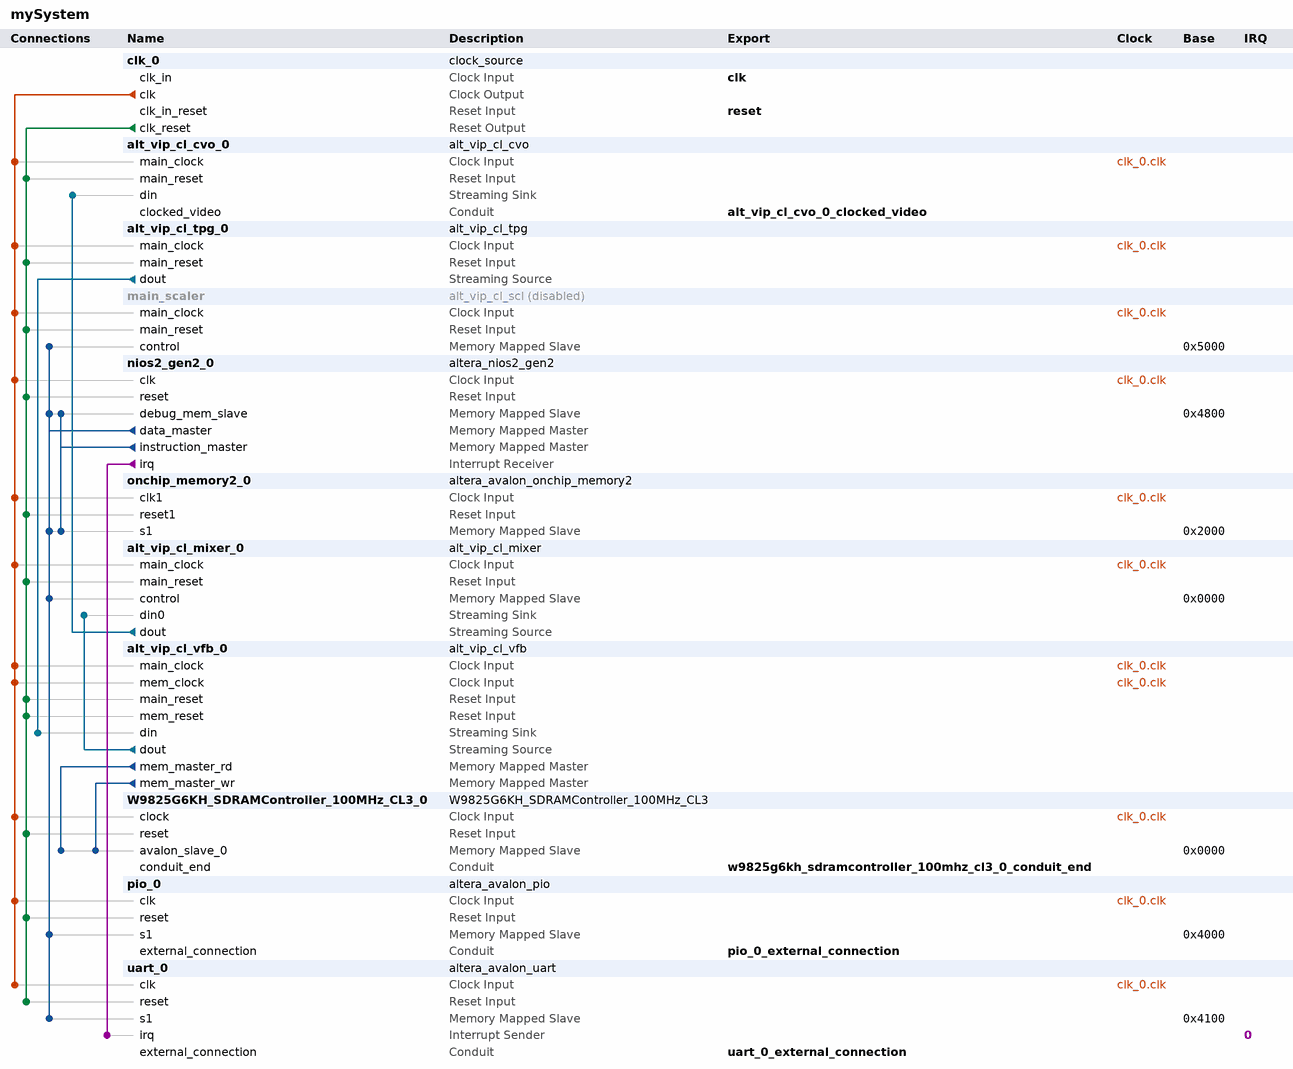
[diagram p0: system contents]
# Platform Designer (Qsys) system mySystem, Cyclone 10 LP 10CL016YU484C8G
# Parameters at their usual value, and those the tool derives, are not listed.
package require -exact qsys 18.1
create_system mySystem
set_project_property DEVICE_FAMILY {Cyclone 10 LP}
set_project_property DEVICE 10CL016YU484C8G

add_instance clk_0 clock_source 18.1
set_instance_parameter_value clk_0 clockFrequency 125000000

add_instance alt_vip_cl_cvo_0 alt_vip_cl_cvo 18.1
set_instance_parameter_value alt_vip_cl_cvo_0 ACCEPT_COLOURS_IN_SEQ 0
set_instance_parameter_value alt_vip_cl_cvo_0 ACCEPT_SYNC 0
set_instance_parameter_value alt_vip_cl_cvo_0 ANC_LINE 0
set_instance_parameter_value alt_vip_cl_cvo_0 AP_LINE 0
set_instance_parameter_value alt_vip_cl_cvo_0 BPS 8
set_instance_parameter_value alt_vip_cl_cvo_0 CLOCKS_ARE_SAME 0
set_instance_parameter_value alt_vip_cl_cvo_0 COLOUR_PLANES_ARE_IN_PARALLEL 1
set_instance_parameter_value alt_vip_cl_cvo_0 CONTEXT_WIDTH 8
set_instance_parameter_value alt_vip_cl_cvo_0 COUNT_STEP_IS_PIP_VALUE 0
set_instance_parameter_value alt_vip_cl_cvo_0 DST_WIDTH 8
set_instance_parameter_value alt_vip_cl_cvo_0 FIELD0_ANC_LINE 0
set_instance_parameter_value alt_vip_cl_cvo_0 FIELD0_V_BACK_PORCH 0
set_instance_parameter_value alt_vip_cl_cvo_0 FIELD0_V_BLANK 0
set_instance_parameter_value alt_vip_cl_cvo_0 FIELD0_V_FRONT_PORCH 0
set_instance_parameter_value alt_vip_cl_cvo_0 FIELD0_V_RISING_EDGE 0
set_instance_parameter_value alt_vip_cl_cvo_0 FIELD0_V_SYNC_LENGTH 0
set_instance_parameter_value alt_vip_cl_cvo_0 FIFO_DEPTH 640
set_instance_parameter_value alt_vip_cl_cvo_0 F_FALLING_EDGE 0
set_instance_parameter_value alt_vip_cl_cvo_0 F_RISING_EDGE 0
set_instance_parameter_value alt_vip_cl_cvo_0 GENERATE_SYNC 0
set_instance_parameter_value alt_vip_cl_cvo_0 H_ACTIVE_PIXELS 640
set_instance_parameter_value alt_vip_cl_cvo_0 H_BACK_PORCH 48
set_instance_parameter_value alt_vip_cl_cvo_0 H_BLANK 0
set_instance_parameter_value alt_vip_cl_cvo_0 H_FRONT_PORCH 16
set_instance_parameter_value alt_vip_cl_cvo_0 H_SYNC_LENGTH 96
set_instance_parameter_value alt_vip_cl_cvo_0 INTERLACED 0
set_instance_parameter_value alt_vip_cl_cvo_0 LOW_LATENCY 0
set_instance_parameter_value alt_vip_cl_cvo_0 NO_OF_CHANNELS 1
set_instance_parameter_value alt_vip_cl_cvo_0 NO_OF_MODES 1
set_instance_parameter_value alt_vip_cl_cvo_0 NUMBER_OF_COLOUR_PLANES 3
set_instance_parameter_value alt_vip_cl_cvo_0 PIXELS_IN_PARALLEL 1
set_instance_parameter_value alt_vip_cl_cvo_0 SRC_WIDTH 8
set_instance_parameter_value alt_vip_cl_cvo_0 STD_WIDTH 1
set_instance_parameter_value alt_vip_cl_cvo_0 TASK_WIDTH 8
set_instance_parameter_value alt_vip_cl_cvo_0 THRESHOLD 639
set_instance_parameter_value alt_vip_cl_cvo_0 USE_CONTROL 0
set_instance_parameter_value alt_vip_cl_cvo_0 USE_EMBEDDED_SYNCS 0
set_instance_parameter_value alt_vip_cl_cvo_0 V_ACTIVE_LINES 480
set_instance_parameter_value alt_vip_cl_cvo_0 V_BACK_PORCH 31
set_instance_parameter_value alt_vip_cl_cvo_0 V_BLANK 0
set_instance_parameter_value alt_vip_cl_cvo_0 V_FRONT_PORCH 11
set_instance_parameter_value alt_vip_cl_cvo_0 V_SYNC_LENGTH 2

add_instance alt_vip_cl_tpg_0 alt_vip_cl_tpg 18.1
set_instance_parameter_value alt_vip_cl_tpg_0 BITS_PER_SYMBOL 8
set_instance_parameter_value alt_vip_cl_tpg_0 COLOR_PLANES_ARE_IN_PARALLEL 1
set_instance_parameter_value alt_vip_cl_tpg_0 COLOR_SPACE_0 RGB_444
set_instance_parameter_value alt_vip_cl_tpg_0 COLOR_SPACE_1 RGB_444
set_instance_parameter_value alt_vip_cl_tpg_0 COLOR_SPACE_2 RGB_444
set_instance_parameter_value alt_vip_cl_tpg_0 COLOR_SPACE_3 RGB_444
set_instance_parameter_value alt_vip_cl_tpg_0 COLOR_SPACE_4 RGB_444
set_instance_parameter_value alt_vip_cl_tpg_0 COLOR_SPACE_5 RGB_444
set_instance_parameter_value alt_vip_cl_tpg_0 COLOR_SPACE_6 RGB_444
set_instance_parameter_value alt_vip_cl_tpg_0 COLOR_SPACE_7 RGB_444
set_instance_parameter_value alt_vip_cl_tpg_0 DEFAULT_BOARDER 1
set_instance_parameter_value alt_vip_cl_tpg_0 FAMILY {Cyclone 10 LP}
set_instance_parameter_value alt_vip_cl_tpg_0 INTERLACING PROGRESSIVE
set_instance_parameter_value alt_vip_cl_tpg_0 LIMITED_READBACK 0
set_instance_parameter_value alt_vip_cl_tpg_0 MAX_HEIGHT 200
set_instance_parameter_value alt_vip_cl_tpg_0 MAX_WIDTH 200
set_instance_parameter_value alt_vip_cl_tpg_0 NUMBER_OF_COLOR_PLANES 2
set_instance_parameter_value alt_vip_cl_tpg_0 NUM_CORES 1
set_instance_parameter_value alt_vip_cl_tpg_0 OUTPUT_FORMAT 4.4.4
set_instance_parameter_value alt_vip_cl_tpg_0 PATTERN_0 colorbars
set_instance_parameter_value alt_vip_cl_tpg_0 PATTERN_1 colorbars
set_instance_parameter_value alt_vip_cl_tpg_0 PATTERN_2 colorbars
set_instance_parameter_value alt_vip_cl_tpg_0 PATTERN_3 colorbars
set_instance_parameter_value alt_vip_cl_tpg_0 PATTERN_4 colorbars
set_instance_parameter_value alt_vip_cl_tpg_0 PATTERN_5 colorbars
set_instance_parameter_value alt_vip_cl_tpg_0 PATTERN_6 colorbars
set_instance_parameter_value alt_vip_cl_tpg_0 PATTERN_7 colorbars
set_instance_parameter_value alt_vip_cl_tpg_0 PIPELINE_READY 0
set_instance_parameter_value alt_vip_cl_tpg_0 PIXELS_IN_PARALLEL 1
set_instance_parameter_value alt_vip_cl_tpg_0 RUNTIME_CONTROL 0
set_instance_parameter_value alt_vip_cl_tpg_0 UNIFORM_VALUE_BCR 16
set_instance_parameter_value alt_vip_cl_tpg_0 UNIFORM_VALUE_GCB 16
set_instance_parameter_value alt_vip_cl_tpg_0 UNIFORM_VALUE_RY 16

add_instance main_scaler alt_vip_cl_scl 18.1
set_instance_property main_scaler ENABLED false
set_instance_parameter_value main_scaler ALGORITHM_NAME NEAREST_NEIGHBOUR
set_instance_parameter_value main_scaler ALWAYS_DOWNSCALE 0
set_instance_parameter_value main_scaler ARE_IDENTICAL 0
set_instance_parameter_value main_scaler BITS_PER_SYMBOL 8
set_instance_parameter_value main_scaler DEFAULT_EDGE_THRESH 7
set_instance_parameter_value main_scaler DEFAULT_LOWER_BLUR 0
set_instance_parameter_value main_scaler DEFAULT_UPPER_BLUR 0
set_instance_parameter_value main_scaler ENABLE_FIR 0
set_instance_parameter_value main_scaler EXTRA_PIPELINING 0
set_instance_parameter_value main_scaler FAMILY {Cyclone 10 LP}
set_instance_parameter_value main_scaler H_BANKS 1
set_instance_parameter_value main_scaler H_COEFF_FILE {<enter file name (including full path)>}
set_instance_parameter_value main_scaler H_FRACTION_BITS 7
set_instance_parameter_value main_scaler H_FUNCTION LANCZOS_2
set_instance_parameter_value main_scaler H_INTEGER_BITS 1
set_instance_parameter_value main_scaler H_PHASES 16
set_instance_parameter_value main_scaler H_SIGNED 1
set_instance_parameter_value main_scaler H_SYMMETRIC 0
set_instance_parameter_value main_scaler H_TAPS 8
set_instance_parameter_value main_scaler IS_420 0
set_instance_parameter_value main_scaler IS_422 0
set_instance_parameter_value main_scaler LIMITED_READBACK 1
set_instance_parameter_value main_scaler LOAD_AT_RUNTIME 0
set_instance_parameter_value main_scaler MAX_IN_HEIGHT 1080
set_instance_parameter_value main_scaler MAX_IN_WIDTH 1920
set_instance_parameter_value main_scaler MAX_OUT_HEIGHT 200
set_instance_parameter_value main_scaler MAX_OUT_WIDTH 200
set_instance_parameter_value main_scaler NO_BLANKING 0
set_instance_parameter_value main_scaler PIXELS_IN_PARALLEL 1
set_instance_parameter_value main_scaler PRESERVE_BITS 0
set_instance_parameter_value main_scaler RUNTIME_CONTROL 1
set_instance_parameter_value main_scaler SYMBOLS_IN_PAR 3
set_instance_parameter_value main_scaler SYMBOLS_IN_SEQ 1
set_instance_parameter_value main_scaler USER_PACKET_FIFO_DEPTH 0
set_instance_parameter_value main_scaler USER_PACKET_SUPPORT DISCARD
set_instance_parameter_value main_scaler V_BANKS 1
set_instance_parameter_value main_scaler V_COEFF_FILE {<enter file name (including full path)>}
set_instance_parameter_value main_scaler V_FRACTION_BITS 7
set_instance_parameter_value main_scaler V_FUNCTION LANCZOS_2
set_instance_parameter_value main_scaler V_INTEGER_BITS 1
set_instance_parameter_value main_scaler V_PHASES 16
set_instance_parameter_value main_scaler V_SIGNED 1
set_instance_parameter_value main_scaler V_SYMMETRIC 0
set_instance_parameter_value main_scaler V_TAPS 8

add_instance nios2_gen2_0 altera_nios2_gen2 18.1
set_instance_parameter_value nios2_gen2_0 dcache_size 2048
set_instance_parameter_value nios2_gen2_0 exceptionSlave onchip_memory2_0.s1
set_instance_parameter_value nios2_gen2_0 icache_size 4096
set_instance_parameter_value nios2_gen2_0 impl Tiny
set_instance_parameter_value nios2_gen2_0 resetSlave onchip_memory2_0.s1

add_instance onchip_memory2_0 altera_avalon_onchip_memory2 18.1
set_instance_parameter_value onchip_memory2_0 dataWidth 32
set_instance_parameter_value onchip_memory2_0 dualPort false
set_instance_parameter_value onchip_memory2_0 initMemContent true
set_instance_parameter_value onchip_memory2_0 initializationFileName D:/Users/Frederic/IntelFPGA/Sources/Cyclone10_TPG_speel/software/hallo1/mem_init/mySystem_onchip_memory2_0.hex
set_instance_parameter_value onchip_memory2_0 memorySize 8192
set_instance_parameter_value onchip_memory2_0 useNonDefaultInitFile true

add_instance alt_vip_cl_mixer_0 alt_vip_cl_mixer 18.1
set_instance_parameter_value alt_vip_cl_mixer_0 ALPHA_ENABLE 0
set_instance_parameter_value alt_vip_cl_mixer_0 ALPHA_STREAM_ENABLE0 0
set_instance_parameter_value alt_vip_cl_mixer_0 ALPHA_STREAM_ENABLE1 0
set_instance_parameter_value alt_vip_cl_mixer_0 ALPHA_STREAM_ENABLE10 0
set_instance_parameter_value alt_vip_cl_mixer_0 ALPHA_STREAM_ENABLE11 0
set_instance_parameter_value alt_vip_cl_mixer_0 ALPHA_STREAM_ENABLE12 0
set_instance_parameter_value alt_vip_cl_mixer_0 ALPHA_STREAM_ENABLE13 0
set_instance_parameter_value alt_vip_cl_mixer_0 ALPHA_STREAM_ENABLE14 0
set_instance_parameter_value alt_vip_cl_mixer_0 ALPHA_STREAM_ENABLE15 0
set_instance_parameter_value alt_vip_cl_mixer_0 ALPHA_STREAM_ENABLE16 0
set_instance_parameter_value alt_vip_cl_mixer_0 ALPHA_STREAM_ENABLE17 0
set_instance_parameter_value alt_vip_cl_mixer_0 ALPHA_STREAM_ENABLE18 0
set_instance_parameter_value alt_vip_cl_mixer_0 ALPHA_STREAM_ENABLE19 0
set_instance_parameter_value alt_vip_cl_mixer_0 ALPHA_STREAM_ENABLE2 0
set_instance_parameter_value alt_vip_cl_mixer_0 ALPHA_STREAM_ENABLE3 0
set_instance_parameter_value alt_vip_cl_mixer_0 ALPHA_STREAM_ENABLE4 0
set_instance_parameter_value alt_vip_cl_mixer_0 ALPHA_STREAM_ENABLE5 0
set_instance_parameter_value alt_vip_cl_mixer_0 ALPHA_STREAM_ENABLE6 0
set_instance_parameter_value alt_vip_cl_mixer_0 ALPHA_STREAM_ENABLE7 0
set_instance_parameter_value alt_vip_cl_mixer_0 ALPHA_STREAM_ENABLE8 0
set_instance_parameter_value alt_vip_cl_mixer_0 ALPHA_STREAM_ENABLE9 0
set_instance_parameter_value alt_vip_cl_mixer_0 BITS_PER_SYMBOL 8
set_instance_parameter_value alt_vip_cl_mixer_0 COLOR_PLANES_ARE_IN_PARALLEL 1
set_instance_parameter_value alt_vip_cl_mixer_0 COLOR_SPACE RGB
set_instance_parameter_value alt_vip_cl_mixer_0 DATA_PIPELINE_STAGES 0
set_instance_parameter_value alt_vip_cl_mixer_0 FAMILY {Cyclone 10 LP}
set_instance_parameter_value alt_vip_cl_mixer_0 IS_422 1
set_instance_parameter_value alt_vip_cl_mixer_0 LAYER_POSITION_ENABLE 0
set_instance_parameter_value alt_vip_cl_mixer_0 LIMITED_READBACK 0
set_instance_parameter_value alt_vip_cl_mixer_0 LOW_LATENCY_MODE 0
set_instance_parameter_value alt_vip_cl_mixer_0 MAX_HEIGHT 480
set_instance_parameter_value alt_vip_cl_mixer_0 MAX_WIDTH 640
set_instance_parameter_value alt_vip_cl_mixer_0 NO_OF_INPUTS 1
set_instance_parameter_value alt_vip_cl_mixer_0 NUMBER_OF_COLOR_PLANES 2
set_instance_parameter_value alt_vip_cl_mixer_0 PATTERN colorbars
set_instance_parameter_value alt_vip_cl_mixer_0 PIPELINE_READY 0
set_instance_parameter_value alt_vip_cl_mixer_0 PIXELS_IN_PARALLEL 1
set_instance_parameter_value alt_vip_cl_mixer_0 UNIFORM_VALUE_BCR 0
set_instance_parameter_value alt_vip_cl_mixer_0 UNIFORM_VALUE_GCB 0
set_instance_parameter_value alt_vip_cl_mixer_0 UNIFORM_VALUE_RY 0
set_instance_parameter_value alt_vip_cl_mixer_0 USER_PACKET_FIFO_DEPTH 0
set_instance_parameter_value alt_vip_cl_mixer_0 USER_PACKET_SUPPORT DISCARD

add_instance alt_vip_cl_vfb_0 alt_vip_cl_vfb 18.1
set_instance_parameter_value alt_vip_cl_vfb_0 CLOCKS_ARE_SEPARATE 1
set_instance_parameter_value alt_vip_cl_vfb_0 DROP_FRAMES 0
set_instance_parameter_value alt_vip_cl_vfb_0 DROP_REPEAT_USER 0
set_instance_parameter_value alt_vip_cl_vfb_0 FAMILY {Cyclone 10 LP}
set_instance_parameter_value alt_vip_cl_vfb_0 IS_FRAME_READER 0
set_instance_parameter_value alt_vip_cl_vfb_0 LINE_BASED_BUFFERING 0
set_instance_parameter_value alt_vip_cl_vfb_0 MAX_HEIGHT 480
set_instance_parameter_value alt_vip_cl_vfb_0 MAX_WIDTH 640
set_instance_parameter_value alt_vip_cl_vfb_0 MEM_BASE_ADDR 0
set_instance_parameter_value alt_vip_cl_vfb_0 MEM_BUFFER_OFFSET 16777216
set_instance_parameter_value alt_vip_cl_vfb_0 MEM_PORT_WIDTH 32
set_instance_parameter_value alt_vip_cl_vfb_0 PRIORITIZE_FMAX 0
set_instance_parameter_value alt_vip_cl_vfb_0 READER_RUNTIME_CONTROL 0
set_instance_parameter_value alt_vip_cl_vfb_0 READ_FIFO_DEPTH 64
set_instance_parameter_value alt_vip_cl_vfb_0 REPEAT_FRAMES 0
set_instance_parameter_value alt_vip_cl_vfb_0 USER_PACKETS_MAX_STORAGE 0
set_instance_parameter_value alt_vip_cl_vfb_0 USE_BUFFER_OFFSET 0
set_instance_parameter_value alt_vip_cl_vfb_0 WRITE_BURST_TARGET 32
set_instance_parameter_value alt_vip_cl_vfb_0 WRITE_FIFO_DEPTH 64

add_instance W9825G6KH_SDRAMController_100MHz_CL3_0 W9825G6KH_SDRAMController_100MHz_CL3 1.0

add_instance pio_0 altera_avalon_pio 18.1
set_instance_parameter_value pio_0 direction Output
set_instance_parameter_value pio_0 width 2

add_instance uart_0 altera_avalon_uart 18.1
set_instance_parameter_value uart_0 baud 9600
set_instance_parameter_value uart_0 dataBits 8
set_instance_parameter_value uart_0 fixedBaud true
set_instance_parameter_value uart_0 parity NONE
set_instance_parameter_value uart_0 stopBits 1

# connections
add_connection clk_0.clk alt_vip_cl_cvo_0.main_clock clock
add_connection clk_0.clk alt_vip_cl_mixer_0.main_clock clock
add_connection clk_0.clk alt_vip_cl_tpg_0.main_clock clock
add_connection clk_0.clk alt_vip_cl_vfb_0.main_clock clock
add_connection clk_0.clk alt_vip_cl_vfb_0.mem_clock clock
add_connection clk_0.clk main_scaler.main_clock clock
add_connection clk_0.clk nios2_gen2_0.clk clock
add_connection clk_0.clk onchip_memory2_0.clk1 clock
add_connection clk_0.clk pio_0.clk clock
add_connection clk_0.clk uart_0.clk clock
add_connection clk_0.clk W9825G6KH_SDRAMController_100MHz_CL3_0.clock clock
add_connection clk_0.clk_reset alt_vip_cl_cvo_0.main_reset reset
add_connection clk_0.clk_reset alt_vip_cl_mixer_0.main_reset reset
add_connection clk_0.clk_reset alt_vip_cl_tpg_0.main_reset reset
add_connection clk_0.clk_reset alt_vip_cl_vfb_0.main_reset reset
add_connection clk_0.clk_reset alt_vip_cl_vfb_0.mem_reset reset
add_connection clk_0.clk_reset main_scaler.main_reset reset
add_connection clk_0.clk_reset nios2_gen2_0.reset reset
add_connection clk_0.clk_reset onchip_memory2_0.reset1 reset
add_connection clk_0.clk_reset pio_0.reset reset
add_connection clk_0.clk_reset uart_0.reset reset
add_connection clk_0.clk_reset W9825G6KH_SDRAMController_100MHz_CL3_0.reset reset
add_connection alt_vip_cl_vfb_0.mem_master_rd W9825G6KH_SDRAMController_100MHz_CL3_0.avalon_slave_0 avalon
set_connection_parameter_value alt_vip_cl_vfb_0.mem_master_rd/W9825G6KH_SDRAMController_100MHz_CL3_0.avalon_slave_0 baseAddress 0x0000
add_connection alt_vip_cl_vfb_0.mem_master_wr W9825G6KH_SDRAMController_100MHz_CL3_0.avalon_slave_0 avalon
set_connection_parameter_value alt_vip_cl_vfb_0.mem_master_wr/W9825G6KH_SDRAMController_100MHz_CL3_0.avalon_slave_0 baseAddress 0x0000
add_connection nios2_gen2_0.data_master alt_vip_cl_mixer_0.control avalon
set_connection_parameter_value nios2_gen2_0.data_master/alt_vip_cl_mixer_0.control baseAddress 0x0000
add_connection nios2_gen2_0.data_master main_scaler.control avalon
set_connection_parameter_value nios2_gen2_0.data_master/main_scaler.control baseAddress 0x5000
add_connection nios2_gen2_0.data_master nios2_gen2_0.debug_mem_slave avalon
set_connection_parameter_value nios2_gen2_0.data_master/nios2_gen2_0.debug_mem_slave baseAddress 0x4800
add_connection nios2_gen2_0.data_master onchip_memory2_0.s1 avalon
set_connection_parameter_value nios2_gen2_0.data_master/onchip_memory2_0.s1 baseAddress 0x2000
add_connection nios2_gen2_0.data_master pio_0.s1 avalon
set_connection_parameter_value nios2_gen2_0.data_master/pio_0.s1 baseAddress 0x4000
add_connection nios2_gen2_0.data_master uart_0.s1 avalon
set_connection_parameter_value nios2_gen2_0.data_master/uart_0.s1 baseAddress 0x4100
add_connection nios2_gen2_0.instruction_master nios2_gen2_0.debug_mem_slave avalon
set_connection_parameter_value nios2_gen2_0.instruction_master/nios2_gen2_0.debug_mem_slave baseAddress 0x4800
add_connection nios2_gen2_0.instruction_master onchip_memory2_0.s1 avalon
set_connection_parameter_value nios2_gen2_0.instruction_master/onchip_memory2_0.s1 baseAddress 0x2000
add_connection alt_vip_cl_mixer_0.dout alt_vip_cl_cvo_0.din avalon_streaming
add_connection alt_vip_cl_tpg_0.dout alt_vip_cl_vfb_0.din avalon_streaming
add_connection alt_vip_cl_vfb_0.dout alt_vip_cl_mixer_0.din0 avalon_streaming
add_connection nios2_gen2_0.irq uart_0.irq interrupt
set_connection_parameter_value nios2_gen2_0.irq/uart_0.irq irqNumber 0

# exported interfaces
add_interface alt_vip_cl_cvo_0_clocked_video conduit end
set_interface_property alt_vip_cl_cvo_0_clocked_video EXPORT_OF alt_vip_cl_cvo_0.clocked_video
add_interface clk clock sink
set_interface_property clk EXPORT_OF clk_0.clk_in
add_interface pio_0_external_connection conduit end
set_interface_property pio_0_external_connection EXPORT_OF pio_0.external_connection
add_interface reset reset sink
set_interface_property reset EXPORT_OF clk_0.clk_in_reset
add_interface uart_0_external_connection conduit end
set_interface_property uart_0_external_connection EXPORT_OF uart_0.external_connection
add_interface w9825g6kh_sdramcontroller_100mhz_cl3_0_conduit_end conduit end
set_interface_property w9825g6kh_sdramcontroller_100mhz_cl3_0_conduit_end EXPORT_OF W9825G6KH_SDRAMController_100MHz_CL3_0.conduit_end

set_interconnect_requirement {$system} qsys_mm.clockCrossingAdapter HANDSHAKE
set_interconnect_requirement {$system} qsys_mm.enableEccProtection FALSE
set_interconnect_requirement {$system} qsys_mm.insertDefaultSlave FALSE
set_interconnect_requirement {$system} qsys_mm.maxAdditionalLatency 1

save_system mySystem.qsys
